# EAGLE design 1_Main (EAGLE 7.6.0)
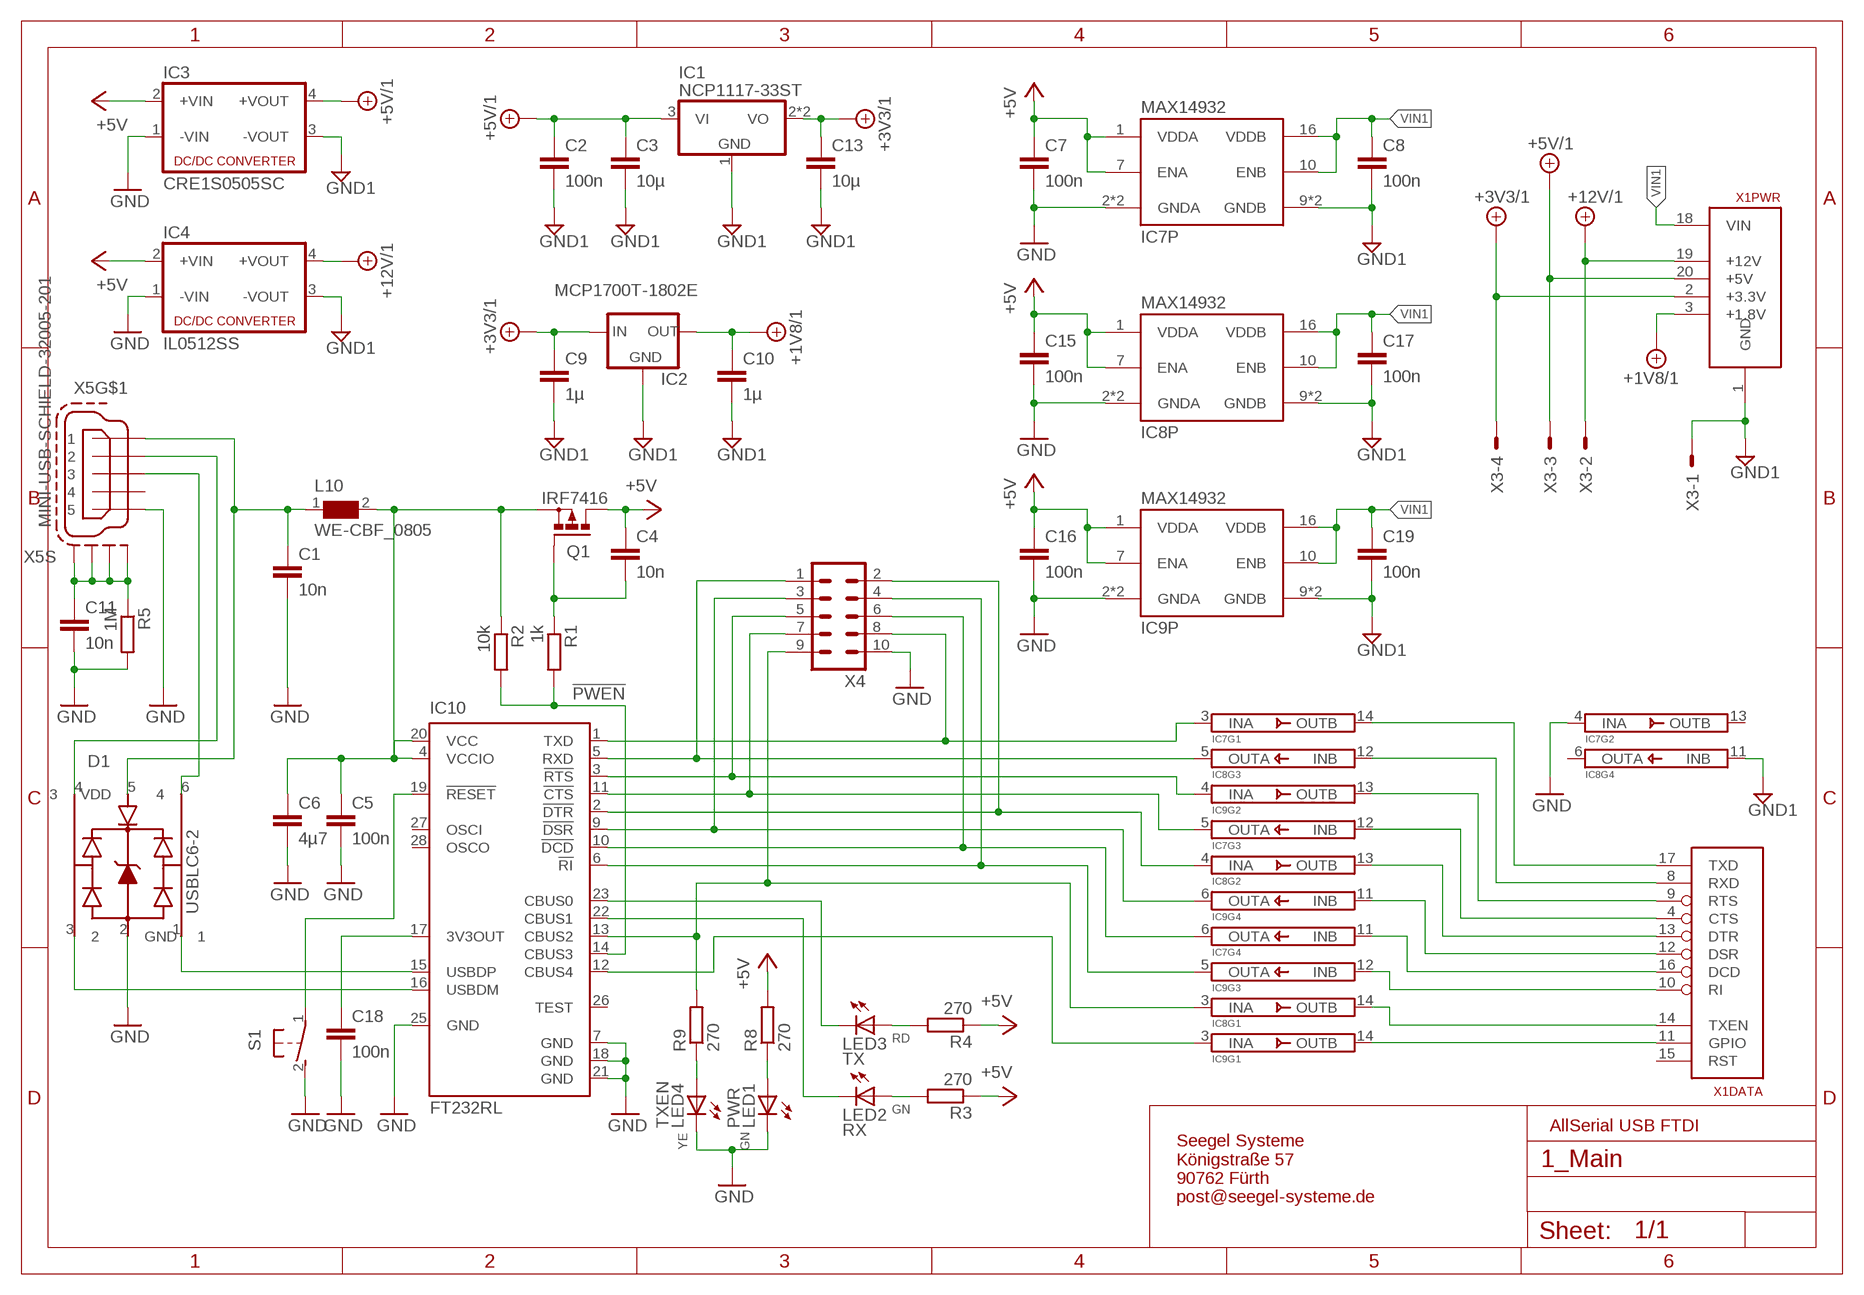
[diagram p0: schematic, sheet 1]

## Parts
C1  10n  C-EUC0805  [C0805]
C2  100n  C-EUC0805  [C0805]
C3  10µ  C-EUC0805  [C0805]
C4  10n  C-EUC0805  [C0805]
C5  100n  C-EUC0805  [C0805]
C6  4µ7  C-EUC0805  [C0805]
C7  100n  C-EUC0805  [C0805]
C8  100n  C-EUC0805  [C0805]
C9  1µ  C-EUC0805  [C0805]
C10  1µ  C-EUC0805  [C0805]
C11  10n  C-EUC0805  [C0805]
C13  10µ  C-EUC0805  [C0805]
C15  100n  C-EUC0805  [C0805]
C16  100n  C-EUC0805  [C0805]
C17  100n  C-EUC0805  [C0805]
C18  100n  C-EUC0805  [C0805]
C19  100n  C-EUC0805  [C0805]
D1  USBLC6-2  WE-TVS_82400102  [WE-TVS_SOT23-6L]
IC1  NCP1117-33ST  [SOT223]
IC2  MCP1700T-1802E  MCP170X  [SOT23]
IC3  CRE1S0505SC  [MURATA-SC]
IC4  IL0512SS  [XPPOWER-SIP]
IC7  MAX14932  [SO16]
IC8  MAX14932  [SO16]
IC9  MAX14932  [SO16]
IC10  FT232RL  [SSOP28]
L10  WE-CBF_0805  [0805]
LED1  PWR  LEDCHIPLED_0603  [CHIPLED_0603]
LED2  RX  LEDCHIPLED_0603  [CHIPLED_0603]
LED3  TX  LEDCHIPLED_0603  [CHIPLED_0603]
LED4  TXEN  LEDCHIPLED_0603  [CHIPLED_0603]
Q1  IRF7416  P-MOSFET-SO8  [SO-08]
R1  1k  R-EU_R0805  [R0805]
R2  10k  R-EU_R0805  [R0805]
R3  270  R-EU_R0805  [R0805]
R4  270  R-EU_R0805  [R0805]
R5  1M  R-EU_R0805  [R0805]
R8  270  R-EU_R0805  [R0805]
R9  270  R-EU_R0805  [R0805]
S1  31-XX  [B3F-31XX]
X1  ALLSERIALMASTERMM  [MAIN-THT]
X3  AKL18X-04W  [AKL182-04]
X4  ML10  [ML10]
X5  MINI-USB-SCHIELD-32005-201  [32005-201]

## Nets
!PWEN: IC10.14(CBUS3) R1.2 R2.2
+1V8/1: C10.1 IC2.2(OUT) X1.3(PWR:+1.8V)
+3V3/1: C9.1 C13.1 IC1.2(VO) IC1.4(VO) IC2.3(IN) X1.2(PWR:+3.3V) X3.P$4
+5V: C4.1 C7.1 C15.1 C16.1 IC3.2(+VIN) IC4.2(+VIN) IC7.1(P:VDDA) IC7.7(P:ENA) IC8.1(P:VDDA) IC8.7(P:ENA) IC9.1(P:VDDA) IC9.7(P:ENA) Q1.5(D) Q1.6(D) Q1.7(D) Q1.8(D) R3.1 R4.1 R8.2
+5V/1: C2.1 C3.1 IC1.3(VI) IC3.4(+VOUT) X1.20(PWR:+5V) X3.P$3
+12V/1: IC4.4(+VOUT) X1.19(PWR:+12V) X3.P$2
GND: C1.2 C5.2 C6.2 C7.2 C11.2 C15.2 C16.2 C18.2 D1.2(GND) IC3.1(-VIN) IC4.1(-VIN) IC7.2(P:GNDA) IC7.4(INA) IC7.8(P:GNDA) IC8.2(P:GNDA) IC8.8(P:GNDA) IC9.2(P:GNDA) IC9.8(P:GNDA) IC10.7(GND) IC10.18(GND) IC10.21(GND) IC10.25(GND) LED1.C LED4.C R5.2 S1.2(S) X4.10 X5.5
GND1: C2.2 C3.2 C8.2 C9.2 C10.2 C13.2 C17.2 C19.2 IC1.1(GND) IC2.1(GND) IC3.3(-VOUT) IC4.3(-VOUT) IC7.9(P:GNDB) IC7.15(P:GNDB) IC8.9(P:GNDB) IC8.11(INB) IC8.15(P:GNDB) IC9.9(P:GNDB) IC9.15(P:GNDB) X1.1(PWR:GND) X3.P$1
N$1: IC8.5(OUTA) IC10.5(RXD) X4.1
N$2: IC9.6(OUTA) IC10.9(!DSR) X4.3
N$3: IC8.3(INA) IC10.13(CBUS2) R9.2 X4.9
N$4: LED2.A R3.2
N$5: IC10.19(!RESET) S1.1(P)
N$6: LED3.A R4.2
N$7: LED4.A R9.1
N$8: LED1.A R8.1
N$9: D1.3 IC10.16(USBDM)
N$10: D1.1 IC10.15(USBDP)
N$11: C1.1 D1.5(VDD) L10.1 X5.1
N$12: D1.4 X5.2
N$13: IC9.3(INA) IC10.12(CBUS4)
N$14: IC7.3(INA) IC10.1(TXD) X4.8
N$15: D1.6 X5.3
N$16: C11.1 R5.1 X5.M1(S:S1) X5.M2(S:S2) X5.M3(S:S3) X5.M4(S:S4)
N$22: C18.1 IC10.17(3V3OUT)
N$29: IC9.4(INA) IC10.3(!RTS) X4.5
N$32: IC7.5(OUTA) IC10.11(!CTS) X4.7
N$33: IC8.4(INA) IC10.2(!DTR) X4.2
N$35: IC7.6(OUTA) IC10.10(!DCD) X4.6
N$36: IC9.5(OUTA) IC10.6(!RI) X4.4
N$38: C5.1 C6.1 IC10.4(VCCIO) IC10.20(VCC) L10.2 Q1.1(S) Q1.2(S) Q1.3(S) R2.1
N$42: C4.2 Q1.4(G) R1.1
N$80: IC7.14(OUTB) X1.17(DATA:TXD)
N$81: IC8.12(INB) X1.8(DATA:RXD)
N$82: IC9.13(OUTB) X1.9(DATA:RTS)
N$83: IC7.12(INB) X1.4(DATA:CTS)
N$84: IC8.13(OUTB) X1.13(DATA:DTR)
N$85: IC9.11(INB) X1.12(DATA:DSR)
N$86: IC7.11(INB) X1.16(DATA:DCD)
N$87: IC9.12(INB) X1.10(DATA:RI)
N$88: IC8.14(OUTB) X1.14(DATA:TXEN)
N$89: IC9.14(OUTB) X1.11(DATA:GPIO)
RXLED: IC10.22(CBUS1) LED2.C
TXLED: IC10.23(CBUS0) LED3.C
VIN1: C8.1 C17.1 C19.1 IC7.10(P:ENB) IC7.16(P:VDDB) IC8.10(P:ENB) IC8.16(P:VDDB) IC9.10(P:ENB) IC9.16(P:VDDB) X1.18(PWR:VIN)
Unconnected: IC7.13(OUTB) IC8.6(OUTA) IC10.26(TEST) IC10.27(OSCI) IC10.28(OSCO) X1.5(USB:D-) X1.6(USB:D+) X1.7(USB:VUSB) X1.15(DATA:RST) X5.4

## Notes on the sheet
- AllSerial USB FTDI
- Seegel Systeme
  Königstraße 57
  90762 Fürth
  post@seegel-systeme.de

## Library data of the parts
C1-C11 C13 C15-C19 = rcl:C-EU: CAPACITOR, European symbol
D1 = EagleLibrary_Wuerth_Elektronik_eiSos_Version_6-9:WE-TVS_82400102: TVS Diode Array WE-TVS, High Speed Series - Low capazity - No leakage current - Low clamping voltage - high ESD voltage protection -- USB 1.0 - 2.0 Flow Thru Design
IC1 = linear:NCP1117
IC2 = SeeSys:MCP170X
IC3 = dc-dc-converter:CRE1S*?
IC4 = dc-dc-converter:IL*S
IC7-IC9 = max14932:MAX14932
IC10 = ftdichip:FT232R: Source: http://www.ftdichip.com/Documents/DataSheets/DS_FT232R_v104.pdf; MPN: FT232RL; OC_FARNELL: 1146032; OC_NEWARK: 91K9918
L10 = EagleLibrary_Wuerth_Elektronik_eiSos_Version_6-12:WE-CBF: SMD EMI Suppression Ferrite Beads WE-CBF - Excellent anti-EMI properties - Low DC-restistance - Impedances till 3000 ohms - Rated current up to 6 A -- Reliable Ni-Sn electrodes -- Perfect as data lined filter and for uncoupling of distribution voltage
LED1 LED2 = led:LED: LED OSRAM: - CHIPLED LG R971, LG N971, LY N971, LG Q971, LY Q971, LO R971, LY R971 LH N974, LH R974 LS Q976, LO Q976, LY Q976 LO Q996 - Hyper CHIPLED LW Q18S LB Q993, LB Q99A, LB R99A - SideLED LS A670, LO A670, LY A670, LG A670, LP A670 LB A673, LV A673, LT A673, LW A673 LH A674 LY A675 LS A676, LA A676, LO A676, LY A676, LW A676 LS A679, LY A679, LG A679 - Hyper Micro SIDELED® LS Y876, LA Y876, LO Y876, LY Y876 LT Y87S - SmartLED LW L88C, LW L88S LB L89C, LB L89S, LG L890 LS L89K, LO L89K, LY L89K LS L896, LA L896, LO L896, LY L896 - TOPLED LS T670, LO T670, LY T670, LG T670, LP T670 LSG T670, LSP T670, LSY T670, LOP T670, LYG T670 LG T671, LOG T671, LSG T671 LB T673, LV T673, LT T673, LW T673 LH T674 LS T676, LA T676, LO T676, LY T676, LB T676, LH T676, LSB T676, LW T676 LB T67C, LV T67C, LT T67C, LS T67K, LO T67K, LY T67K, LW E67C LS E67B, LA E67B, LO E67B, LY E67B, LB E67C, LV E67C, LT E67C LW T67C LS T679, LY T679, LG T679 LS T770, LO T770, LY T770, LG T770, LP T770 LB T773, LV T773, LT T773, LW T773 LH T774 LS E675, LA E675, LY E675, LS T675 LS T776, LA T776, LO T776, LY T776, LB T776 LHGB T686 LT T68C, LB T68C - Hyper Mini TOPLED® LB M676 - Mini TOPLED Santana® LG M470 LS M47K, LO M47K, LY M47K Source: http://www.osram.convergy.de LUXEON: - LUMILED® LXK2-PW12-R00, LXK2-PW12-S00, LXK2-PW14-U00, LXK2-PW14-V00 LXK2-PM12-R00, LXK2-PM12-S00, LXK2-PM14-U00 LXK2-PE12-Q00, LXK2-PE12-R00, LXK2-PE12-S00, LXK2-PE14-T00, LXK2-PE14-U00 LXK2-PB12-K00, LXK2-PB12-L00, LXK2-PB12-M00, LXK2-PB14-N00, LXK2-PB14-P00, LXK2-PB14-Q00 LXK2-PR12-L00, LXK2-PR12-M00, LXK2-PR14-Q00, LXK2-PR14-R00 LXK2-PD12-Q00, LXK2-PD12-R00, LXK2-PD12-S00 LXK2-PH12-R00, LXK2-PH12-S00 LXK2-PL12-P00, LXK2-PL12-Q00, LXK2-PL12-R00 Source: www.luxeon.com KINGBRIGHT: KA-3528ASYC Source: www.kingbright.com; COLOR: GN
LED3 = led:LED: LED OSRAM: - CHIPLED LG R971, LG N971, LY N971, LG Q971, LY Q971, LO R971, LY R971 LH N974, LH R974 LS Q976, LO Q976, LY Q976 LO Q996 - Hyper CHIPLED LW Q18S LB Q993, LB Q99A, LB R99A - SideLED LS A670, LO A670, LY A670, LG A670, LP A670 LB A673, LV A673, LT A673, LW A673 LH A674 LY A675 LS A676, LA A676, LO A676, LY A676, LW A676 LS A679, LY A679, LG A679 - Hyper Micro SIDELED® LS Y876, LA Y876, LO Y876, LY Y876 LT Y87S - SmartLED LW L88C, LW L88S LB L89C, LB L89S, LG L890 LS L89K, LO L89K, LY L89K LS L896, LA L896, LO L896, LY L896 - TOPLED LS T670, LO T670, LY T670, LG T670, LP T670 LSG T670, LSP T670, LSY T670, LOP T670, LYG T670 LG T671, LOG T671, LSG T671 LB T673, LV T673, LT T673, LW T673 LH T674 LS T676, LA T676, LO T676, LY T676, LB T676, LH T676, LSB T676, LW T676 LB T67C, LV T67C, LT T67C, LS T67K, LO T67K, LY T67K, LW E67C LS E67B, LA E67B, LO E67B, LY E67B, LB E67C, LV E67C, LT E67C LW T67C LS T679, LY T679, LG T679 LS T770, LO T770, LY T770, LG T770, LP T770 LB T773, LV T773, LT T773, LW T773 LH T774 LS E675, LA E675, LY E675, LS T675 LS T776, LA T776, LO T776, LY T776, LB T776 LHGB T686 LT T68C, LB T68C - Hyper Mini TOPLED® LB M676 - Mini TOPLED Santana® LG M470 LS M47K, LO M47K, LY M47K Source: http://www.osram.convergy.de LUXEON: - LUMILED® LXK2-PW12-R00, LXK2-PW12-S00, LXK2-PW14-U00, LXK2-PW14-V00 LXK2-PM12-R00, LXK2-PM12-S00, LXK2-PM14-U00 LXK2-PE12-Q00, LXK2-PE12-R00, LXK2-PE12-S00, LXK2-PE14-T00, LXK2-PE14-U00 LXK2-PB12-K00, LXK2-PB12-L00, LXK2-PB12-M00, LXK2-PB14-N00, LXK2-PB14-P00, LXK2-PB14-Q00 LXK2-PR12-L00, LXK2-PR12-M00, LXK2-PR14-Q00, LXK2-PR14-R00 LXK2-PD12-Q00, LXK2-PD12-R00, LXK2-PD12-S00 LXK2-PH12-R00, LXK2-PH12-S00 LXK2-PL12-P00, LXK2-PL12-Q00, LXK2-PL12-R00 Source: www.luxeon.com KINGBRIGHT: KA-3528ASYC Source: www.kingbright.com; COLOR: RD
LED4 = led:LED: LED OSRAM: - CHIPLED LG R971, LG N971, LY N971, LG Q971, LY Q971, LO R971, LY R971 LH N974, LH R974 LS Q976, LO Q976, LY Q976 LO Q996 - Hyper CHIPLED LW Q18S LB Q993, LB Q99A, LB R99A - SideLED LS A670, LO A670, LY A670, LG A670, LP A670 LB A673, LV A673, LT A673, LW A673 LH A674 LY A675 LS A676, LA A676, LO A676, LY A676, LW A676 LS A679, LY A679, LG A679 - Hyper Micro SIDELED® LS Y876, LA Y876, LO Y876, LY Y876 LT Y87S - SmartLED LW L88C, LW L88S LB L89C, LB L89S, LG L890 LS L89K, LO L89K, LY L89K LS L896, LA L896, LO L896, LY L896 - TOPLED LS T670, LO T670, LY T670, LG T670, LP T670 LSG T670, LSP T670, LSY T670, LOP T670, LYG T670 LG T671, LOG T671, LSG T671 LB T673, LV T673, LT T673, LW T673 LH T674 LS T676, LA T676, LO T676, LY T676, LB T676, LH T676, LSB T676, LW T676 LB T67C, LV T67C, LT T67C, LS T67K, LO T67K, LY T67K, LW E67C LS E67B, LA E67B, LO E67B, LY E67B, LB E67C, LV E67C, LT E67C LW T67C LS T679, LY T679, LG T679 LS T770, LO T770, LY T770, LG T770, LP T770 LB T773, LV T773, LT T773, LW T773 LH T774 LS E675, LA E675, LY E675, LS T675 LS T776, LA T776, LO T776, LY T776, LB T776 LHGB T686 LT T68C, LB T68C - Hyper Mini TOPLED® LB M676 - Mini TOPLED Santana® LG M470 LS M47K, LO M47K, LY M47K Source: http://www.osram.convergy.de LUXEON: - LUMILED® LXK2-PW12-R00, LXK2-PW12-S00, LXK2-PW14-U00, LXK2-PW14-V00 LXK2-PM12-R00, LXK2-PM12-S00, LXK2-PM14-U00 LXK2-PE12-Q00, LXK2-PE12-R00, LXK2-PE12-S00, LXK2-PE14-T00, LXK2-PE14-U00 LXK2-PB12-K00, LXK2-PB12-L00, LXK2-PB12-M00, LXK2-PB14-N00, LXK2-PB14-P00, LXK2-PB14-Q00 LXK2-PR12-L00, LXK2-PR12-M00, LXK2-PR14-Q00, LXK2-PR14-R00 LXK2-PD12-Q00, LXK2-PD12-R00, LXK2-PD12-S00 LXK2-PH12-R00, LXK2-PH12-S00 LXK2-PL12-P00, LXK2-PL12-Q00, LXK2-PL12-R00 Source: www.luxeon.com KINGBRIGHT: KA-3528ASYC Source: www.kingbright.com; COLOR: YE
Q1 = transistor-power:P-MOSFET-SO8: P-Channel MOSFET Example: FDS4435A; P-Channel Logic Level PowerTrench® MOSFET FDS4465; P-Channel 1.8V Specified PowerTrench® MOSFET Source: www.fairchildsemi.com
R1-R5 R8 R9 = rcl:R-EU_: RESISTOR, European symbol
S1 = switch-omron:31-XX: OMRON SWITCH; MPN: B3F-3100; OC_FARNELL: 959704; OC_NEWARK: 36M3582
X1 = AllSerialv2:ALLSERIALMASTER
X3 = con-riacon_akl:AKL18X-04: Riacon AKL18X Steckverbinder 4-Pol Grid = 3,5mm
X4 = con-harting-ml:ML10: HARTING; OC_FARNELL: unknown; OC_NEWARK: unknown
X5 = con-cypressindustries:MINI-USB-SCHIELD-: MINI USB-B Conector Source: www.cypressindustries.com; OC_FARNELL: unknown; OC_NEWARK: unknown

## Board
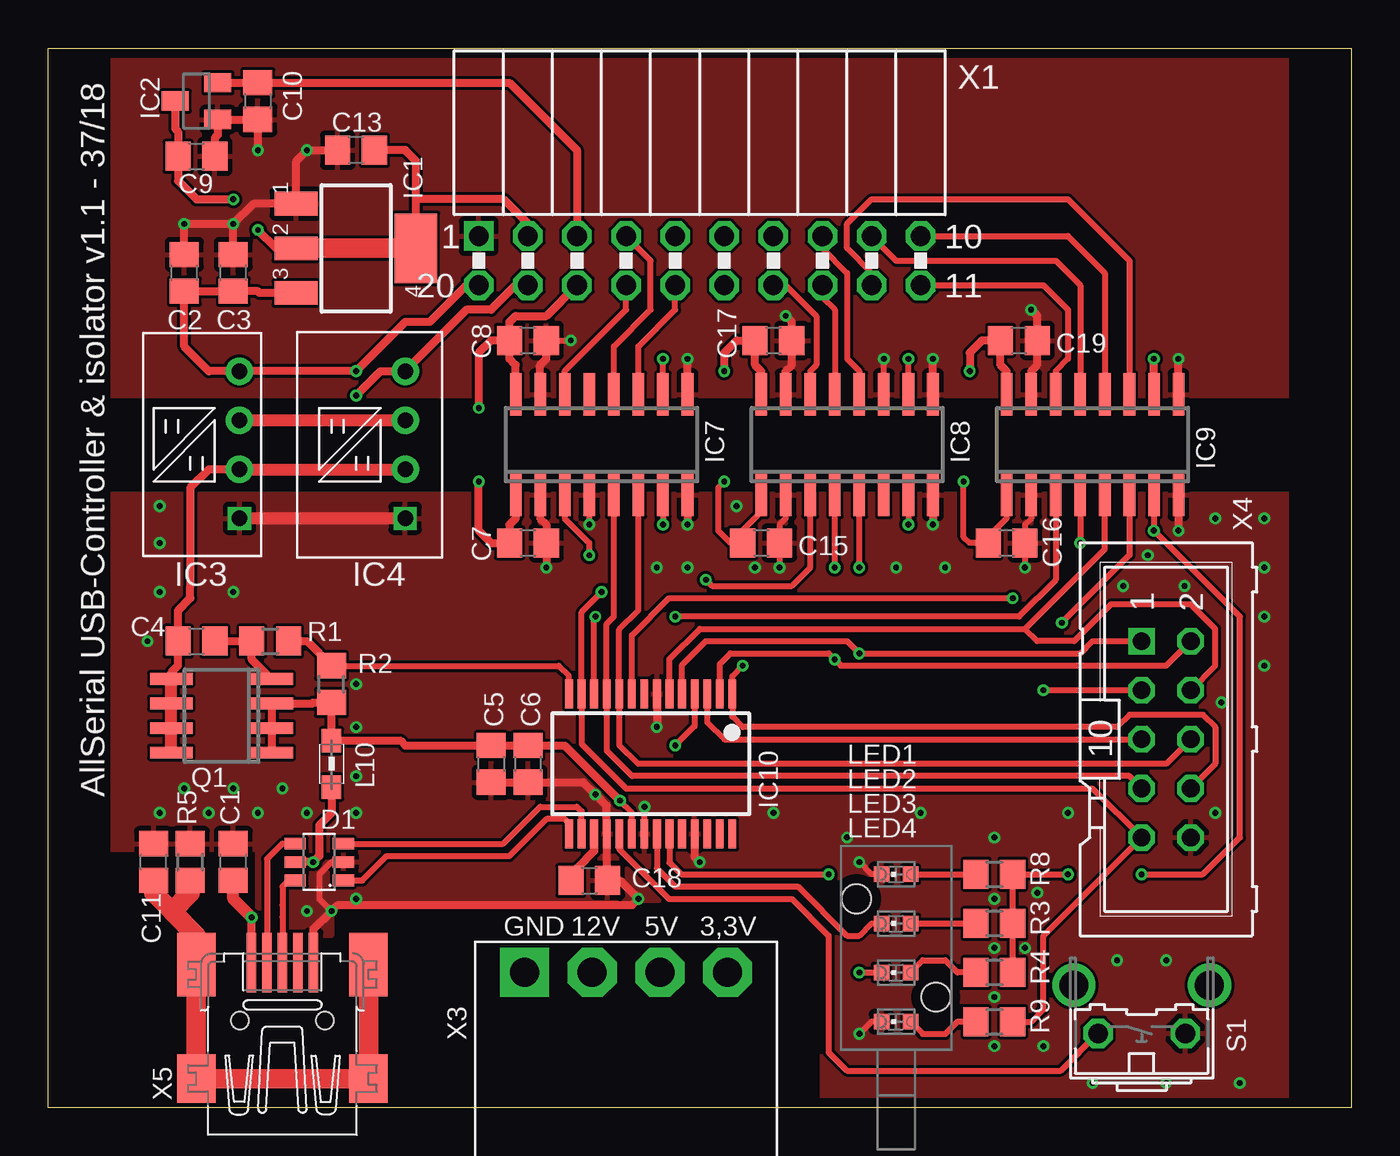
[diagram p1: board, top side]
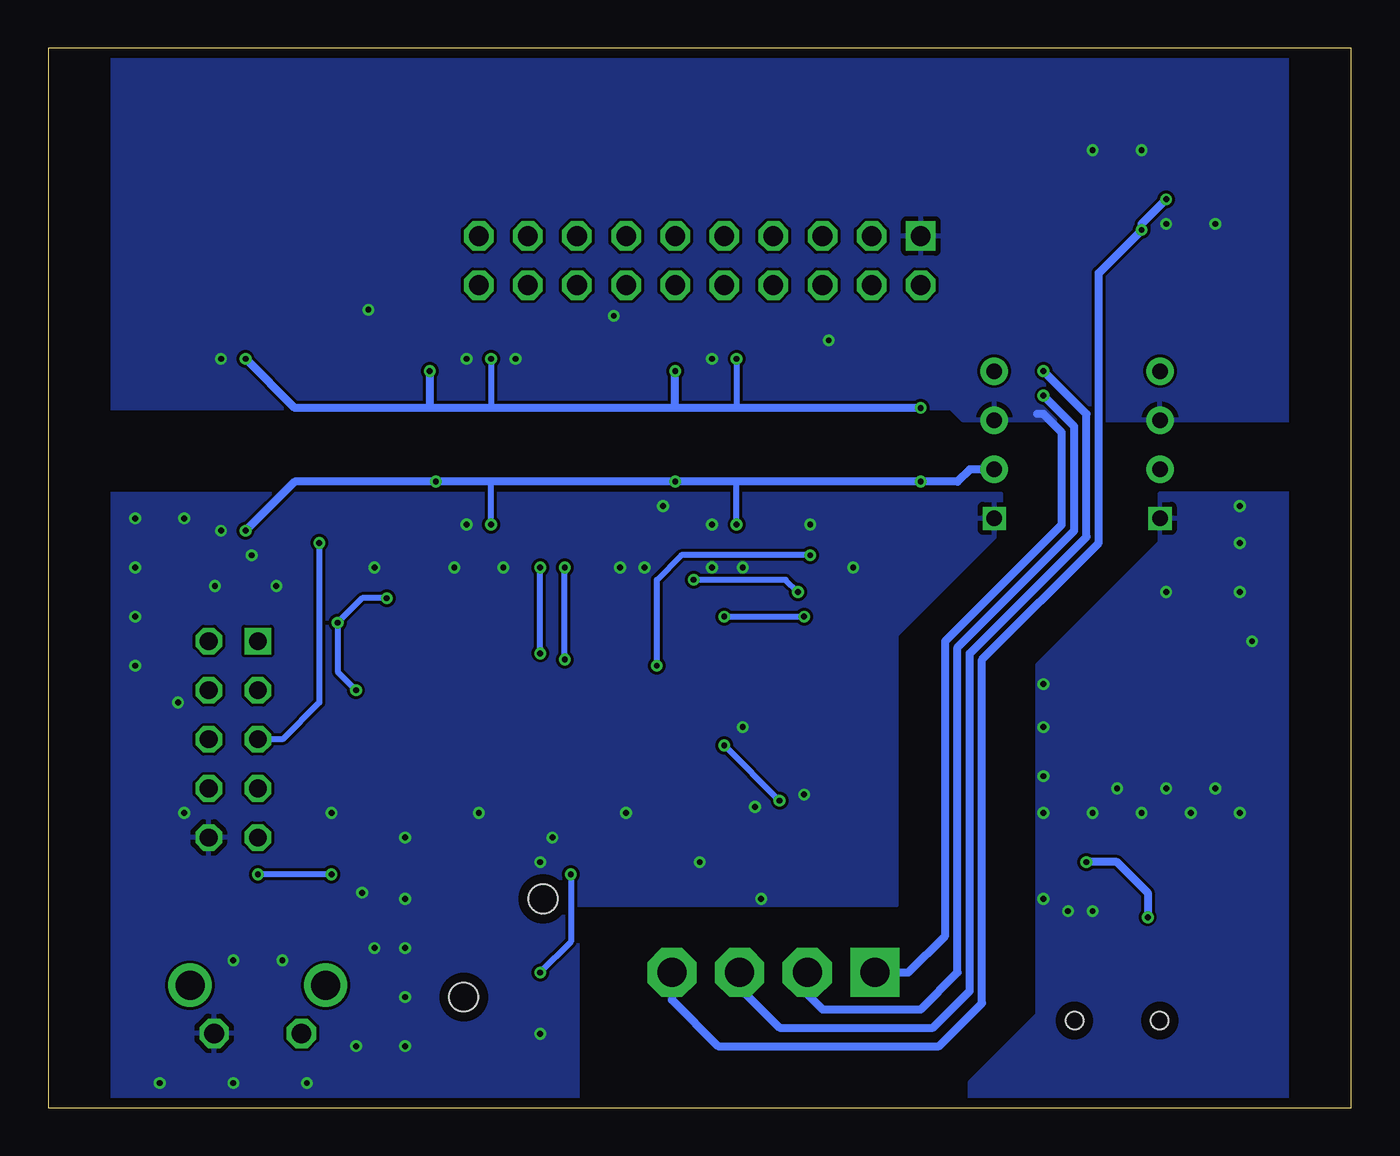
[diagram p2: board, bottom side, seen from below]

Size 67.4 x 54.8 mm. Coordinates in mm from the lower left corner, seen from the top.
Copper layers (1*16): Top 0.035mm / dielectric 1.6mm / Bottom 0.035mm
Design rules "Elecrow_2-layer_PCB_eagle_rule *": minimum track width 6mil, minimum drill 0.3mm, track to track 6mil, track to pad 6mil, pad to pad 6mil, via to via 8mil, smd to smd 0mil, copper to edge 20mil, drill to drill 10mil, minimum pad ring 6mil, minimum via ring 6mil, stop-mask expansion 0mil, vias tented up to drill 100mil, thermal gap 10mil

### Footprints (pad centres in the part's own frame; a part is rotated, then mirrored left to right if it is on the bottom)
C0805 = smd 1.3 x 1.5: 1 -0.95,0; 2 0.95,0
WE-TVS_SOT23-6L = smd 0.6 x 1.1: 1 -0.95,-1.25; 2 0,-1.25; 3 0.95,-1.25; 4 0.95,1.25; 5 0,1.25; 6 -0.95,1.25
SOT223 = smd 1.219 x 2.235: 1 -2.311,-3.099; 2 0,-3.099; 3 2.311,-3.099 | smd 3.6 x 2.2: 4 0,3.099
SOT23 = smd 1 x 1.4: 1 -0.95,-1.1; 2 0.95,-1.1; 3 0,1.1
MURATA-SC = drill 0.8 square: 1 -3.81,0 | drill 0.8 pad 1.422: 2 -1.27,0; 3 1.27,0; 4 3.81,0
XPPOWER-SIP = drill 0.8 square: 1 -3.81,0 | drill 0.8 pad 1.422: 2 -1.27,0; 3 1.27,0; 4 3.81,0
SO16 = smd 0.6 x 2.2: 1 -4.445,-2.6; 2 -3.175,-2.6; 3 -1.905,-2.6; 4 -0.635,-2.6; 5 0.635,-2.6; 6 1.905,-2.6; 7 3.175,-2.6; 8 4.445,-2.6; 9 4.445,2.6; 10 3.175,2.6; 11 1.905,2.6; 12 0.635,2.6; 13 -0.635,2.6; 14 -1.905,2.6; 15 -3.175,2.6; 16 -4.445,2.6
SSOP28 = smd 0.4 x 1.5: 1 -4.225,-3.625; 2 -3.575,-3.625; 3 -2.925,-3.625; 4 -2.275,-3.625; 5 -1.625,-3.625; 6 -0.975,-3.625; 7 -0.325,-3.625; 8 0.325,-3.625; 9 0.975,-3.625; 10 1.625,-3.625; 11 2.275,-3.625; 12 2.925,-3.625; 13 3.575,-3.625; 14 4.225,-3.625; 15 4.225,3.625; 16 3.575,3.625; 17 2.925,3.625; 18 2.275,3.625; 19 1.625,3.625; 20 0.975,3.625; 21 0.325,3.625; 22 -0.325,3.625; 23 -0.975,3.625; 24 -1.625,3.625; 25 -2.275,3.625; 26 -2.925,3.625; 27 -3.575,3.625; 28 -4.225,3.625
0805 = smd 1.2 x 1: 1 -1.2,0; 2 1.2,0
CHIPLED_0603 = smd 0.8 x 0.8: A 0,-0.75; C 0,0.75
SO-08 = smd 0.6 x 2.2: 1 -1.905,-2.6; 2 -0.635,-2.6; 3 0.635,-2.6; 4 1.905,-2.6; 5 1.905,2.6; 6 0.635,2.6; 7 -0.635,2.6; 8 -1.905,2.6
R0805 = smd 1.3 x 1.5: 1 -0.95,0; 2 0.95,0
B3F-31XX = drill 1.016 octagon: 1 -2.261,-1.245; 2 2.261,-1.245 | drill 1.499 pad 2.159: 3 -3.505,1.245; 4 3.505,1.245
1296.1004 = hole 1.5: 2.05,-2.54; -2.05,2.54
MAIN-THT = drill 1.016 square: 1 -11.43,45.085 | drill 1.016 octagon: 2 -8.89,45.085; 3 -6.35,45.085; 4 -3.81,45.085; 5 -1.27,45.085; 6 1.27,45.085; 7 3.81,45.085; 8 6.35,45.085; 9 8.89,45.085; 10 11.43,45.085; 11 11.43,42.545; 12 8.89,42.545; 13 6.35,42.545; 14 3.81,42.545; 15 1.27,42.545; 16 -1.27,42.545; 17 -3.81,42.545; 18 -6.35,42.545; 19 -8.89,42.545; 20 -11.43,42.545
AKL182-04 = drill 1.5 pad 2.54 square: P$1 -5.25,0 | drill 1.5 pad 2.54 octagon: P$2 -1.75,0; P$3 1.75,0; P$4 5.25,0
ML10 = drill 0.914 square: 1 -5.08,-1.27 | drill 0.914 octagon: 2 -5.08,1.27; 3 -2.54,-1.27; 4 -2.54,1.27; 5 0,-1.27; 6 0,1.27; 7 2.54,-1.27; 8 2.54,1.27; 9 5.08,-1.27; 10 5.08,1.27
32005-201 = smd 3.1 x 0.5: 1 3,1.6; 2 3,0.8; 3 3,0; 4 3,-0.8; 5 3,-1.6 | smd 2.5 x 2: M1 -3,-4.45; M2 -3,4.45 | smd 3.3 x 2: M3 2.9,4.45; M4 2.9,-4.45 | hole 0.9: 0,2.2; 0,-2.2

### Placement (x,y rotation side)
C1  9.57,12.7 90 top
C2  7.03,43.18 90 top
C3  9.57,43.18 90 top
C4  7.67,24.13 0 top
C5  22.91,17.78 270 top
C6  24.81,17.78 270 top
C7  24.81,29.21 0 top
C8  24.81,39.69 0 top
C9  7.67,49.21 0 top
C10  10.84,52.07 270 top
C11  5.44,12.7 90 top
C13  15.92,49.53 180 top
C15  36.88,29.21 0 top
C16  49.58,29.21 0 top
C17  37.51,39.69 0 top
C18  27.99,11.75 0 top
C19  50.21,39.69 0 top
D1  14.02,12.7 90 top
IC1  15.92,44.45 270 top
IC2  7.67,52.07 90 top
IC3  9.89,34.29 90 top
IC4  18.46,34.29 90 top
IC7  28.62,34.29 0 top
IC8  41.32,34.29 0 top
IC9  54.02,34.29 0 top
IC10  31.16,17.78 180 top
L10  14.65,17.78 90 top
LED1  43.86,12.06 90 top
LED2  43.86,9.53 90 top
LED3  43.86,6.99 90 top
LED4  43.86,4.45 90 top
Q1  8.96,20.27 90 top
R1  11.48,24.13 0 top
R2  14.65,21.91 90 top
R3  48.94,9.53 180 top
R4  48.94,6.99 180 top
R5  7.35,12.7 90 top
R8  48.94,12.06 0 top
R9  48.94,4.45 0 top
S1  56.56,5.08 0 top
U$3  [1296.1004]  43.86,8.26 180 top
X1  33.7,0 0 top
X3  29.89,6.99 0 top
X4  57.83,19.05 270 top
X5  12.11,4.5 90 top

### Tracks (layer width: path | path; a pad name or v marks a point on that pad's centre or on a via)
!PWEN
  Top 0.305: R2.2 26.4,22.86 26.94,22.32 IC10.14
  Top 0.406: R1.2 13.38,24.13 R2.2
+1V8/1
  Top 0.406: IC2.2 C10.1 23.86,53.02 27.35,49.53 X1.3
+3V3/1  (via drill 0.3)
  Top 0.406: IC1.4 19.02,46.99 | 19.02,46.99 19.02,48.97 18.46,49.53 C13.1 | X1.2 24.81,45.72 23.54,46.99 19.02,46.99 | IC2.3 6.57,50.63 6.71,50.48 C9.1 6.72,47.94 7.67,46.99 v9.57,46.99 | IC1.2 11.79,44.45 v10.84,45.4
  Top 1.016: IC1.2 IC1.4
  Bottom 0.406: X3.P$4 35.14,5.57 32.75,3.17 21.32,3.17 19.1,5.4 19.1,23.18 13.06,29.21 13.06,43.18 v10.84,45.4 10.84,45.72 v9.57,46.99
+5V  (via drill 0.3)
  Top 0.305: IC7.7 v31.8,30.16 | IC8.7 v44.5,30.16 | IC9.7 v57.2,29.84 61.64,25.4 61.64,13.97 59.73,12.06 v56.56,12.06 | R4.1 R3.1 R8.2 v52.75,12.06 | IC8.1 36.88,30.8 35.92,29.84 C15.1 35.29,29.21 34.65,29.84 34.65,32.07 v34.97,32.38 | IC9.1 49.58,30.48 48.94,29.84 48.94,29.52 C16.1 47.67,29.21 47.35,29.53 v47.35,32.38
  Top 0.406: IC7.1 24.18,30.48 23.86,30.16 C7.1 22.91,29.21 22.27,29.84 v22.27,32.38 | Q1.5 6.36,22.51 6.71,22.86 6.71,23.49 C4.1 6.72,25.71 7.35,26.35 7.35,26.99 7.35,32.07 8.3,33.02 IC3.2
  Top 0.61: IC3.2 IC4.2 | Q1.8 Q1.7 Q1.6 Q1.5
  Bottom 0.305: v31.8,30.16 31.8,32.38 | v44.5,30.16 44.5,32.38 | v52.75,12.06 v56.56,12.06
  Bottom 0.406: IC4.2 19.73,33.02 20.37,32.38 v22.27,32.38 31.8,32.38 v34.97,32.38 44.5,32.38 v47.35,32.38 54.66,32.38 v57.2,29.84
+5V/1  (via drill 0.3)
  Top 0.406: IC1.3 10.93,42.14 10.84,42.23 C3.1 C2.1 7.03,39.37 8.3,38.1 IC3.4 v15.92,38.1 18.46,40.64 19.73,40.64 21.64,42.55 X1.20
  Bottom 0.406: X3.P$3 31.64,6.2 29.57,4.13 21.64,4.13 19.73,6.03 19.73,23.5 13.7,29.53 13.7,35.88 v15.92,38.1
+12V/1  (via drill 0.3)
  Top 0.406: v15.92,36.83 17.19,38.1 IC4.4 21.64,41.27 22.91,41.27 24.18,42.55 X1.19
  Bottom 0.406: X3.P$2 28.14,5.87 27.35,5.08 22.27,5.08 20.37,6.99 20.37,23.81 14.33,29.84 14.33,35.24 v15.92,36.83
GND  (via drill 0.3)
  Top 0.305: 25.76,29.53 C7.2 | IC7.4 v27.99,30.16 | LED1.C 42.59,12.06 v41.96,12.7 | LED4.C 42.59,4.45 v41.96,3.81 | IC8.2 38.15,30.48 37.83,30.16 C15.2 | IC9.2 50.84,30.48 50.53,30.16 C16.2 v50.53,27.94 | C15.2 v37.83,27.94 | v28.3,16.2 v28.3,16.19 | D1.2 14.65,12.7 14.02,12.06 14.02,10.79 v14.65,10.16 | IC10.21 v30.84,15.55 v30.84,15.56
  Top 0.406: IC7.2 25.45,30.48 25.76,30.16 25.76,29.53 | IC10.7 31.49,19.69 v31.48,19.68 | IC7.8 v33.07,30.16 | C7.2 v25.76,27.94 | IC8.8 v45.77,30.16 | IC9.8 v58.47,29.84 | IC10.25 33.44,12.96 v33.7,12.7 | X5.5 13.71,9.22 v14.65,10.16 14.97,10.48 30.21,10.48 v30.53,10.79 29.57,11.75 C18.2 28.89,11.8 IC10.18 28.89,15.61 v28.3,16.19 27.67,16.83 C6.2 C5.2
  Top 0.61: IC4.1 IC3.1
  other vias: 13.38,10.16 5.76,15.24 8.3,15.24 10.84,15.24 13.38,15.24 7.03,16.51 9.57,16.51 12.11,16.51 15.92,10.79 35.61,31.11 31.48,27.94 33.07,27.94 36.56,27.94 43.86,27.94 46.4,27.94 56.88,28.57 55.61,26.99 58.78,26.99 60.37,30.48 62.91,30.48 62.91,27.94 62.91,25.4 62.91,22.86 60.69,20.95 60.37,15.24 55.29,7.62 57.83,7.62 61.64,1.27 57.83,1.27 54.02,1.27 51.48,3.17 51.16,11.11 50.53,8.26 48.94,8.26 48.94,5.71 48.94,3.17 48.94,10.79 52.75,15.24 48.94,13.97 45.13,15.24 41.32,13.97 37.51,15.24 9.57,26.67 5.76,26.67 5.76,29.21 5.76,31.11 5.13,24.13 15.92,19.68 15.92,21.91 15.92,17.14 15.92,15.24
  pour Bottom: 23.54,10.48 40.05,10.48 40.05,0 67.99,0 67.99,31.75 18.14,31.75 18.14,29.84 23.54,24.45
  pour Bottom: -0.59,31.75 9.89,31.75 9.89,29.21 16.24,22.86 16.24,4.76 19.73,1.27 19.73,0 -0.59,0
  pour Top: -0.59,31.75 67.99,31.75 67.99,0 40.05,0 40.05,10.79 14.65,10.48 14.65,8.89 10.84,8.89 10.84,13.34 -0.27,13.34
GND1  (via drill 0.3)
  Top 0.305: 25.76,39.37 C8.2 v27.03,39.69 | C17.2 | IC8.11 v43.23,38.73 | C19.2
  Top 0.406: IC7.15 25.45,38.42 25.76,38.73 25.76,39.37 | IC8.15 38.15,38.1 38.46,38.42 C17.2 | v9.57,45.72 10.61,46.76 IC1.1 12.82,48.97 v13.38,49.53 C13.2 | C2.2 v7.03,45.72 v9.57,45.72 | C3.2 v9.57,45.72 | C17.2 38.46,40.64 v38.15,40.96 | IC7.9 v33.07,38.73 | IC8.9 v45.77,38.73 | IC9.15 50.84,38.1 51.16,38.42 C19.2 | IC9.9 v58.47,38.73 | 51.16,40.96 v50.84,41.27 51.16,40.96 C19.2 | C9.2 8.62,50.16 8.77,50.31 IC2.1 C10.2 v10.84,49.53
  Top 0.61: IC3.3 IC4.3
  Bottom 0.406: X3.P$1 22.91,6.99 21,8.89 21,24.13 14.97,30.16 14.97,34.92 15.92,35.88 16.24,35.88
  pour Bottom: -0.59,54.61 -0.59,35.56 20.05,35.56 20.68,36.2 67.99,36.2 67.99,54.61
  pour Top: -0.59,36.83 67.99,36.83 67.99,54.61 -0.59,54.61
N$1  (via drill 0.3)
  Top 0.305: IC10.5 32.79,22.9 34.02,24.13 41.32,24.13 v41.96,23.5 53.39,23.5 54.02,24.13 X4.1 | v41.96,27.94 IC8.5
  Bottom 0.305: v41.96,23.5 v41.96,27.94
N$2  (via drill 0.3)
  Top 0.305: IC10.9 30.19,24.43 32.11,26.35 v49.89,26.35 | X4.3 v51.48,21.59 | IC9.6 55.93,28.57 v52.43,25.08
  Bottom 0.305: v51.48,21.59 52.43,22.54 v52.43,25.08 51.16,26.35 v49.89,26.35
N$3  (via drill 0.3)
  Top 0.305: v28.62,26.67 27.59,25.64 IC10.13 27.59,18.82 29.89,16.51 54.02,16.51 X4.9 51.48,8.89 51.48,5.08 50.84,4.45 R9.2 | v34.02,27.3 34.34,26.99 38.46,26.99 39.42,27.94 IC8.3
  Bottom 0.305: v28.62,26.67 29.26,27.3 v34.02,27.3
N$4
  Top 0.305: LED2.A R3.2
N$5
  Top 0.305: IC10.19 29.54,13.37 32.11,10.79 38.46,10.79 40.37,8.89 40.37,2.86 41.32,1.91 52.37,1.91 S1.1
N$6
  Top 0.305: LED3.A 45.25,7.62 46.4,7.62 47.04,6.99 R4.2
N$7
  Top 0.305: LED4.A 45.25,3.81 46.4,3.81 47.04,4.45 R9.1
N$8
  Top 0.305: LED1.A R8.1
N$9
  Top 0.305: D1.3 23.54,13.65 25.45,15.56 27.35,15.56 27.59,15.32 IC10.16
N$10
  Top 0.305: IC10.15 26.94,14.7 26.72,14.92 25.76,14.92 23.86,13.02 17.51,13.02 16.24,11.75 D1.1
N$11  (via drill 0.3)
  Top 0.406: L10.1 14.65,15.24 14.02,14.61 14.02,13.02 v13.7,12.7 D1.5 | X5.1 v10.51,9.83 v10.52,9.84
  Top 0.61: C1.1 9.57,10.79 v10.52,9.84
  Bottom 0.406: v13.7,12.7 12.11,12.7 10.52,11.11 v10.52,9.84
N$12
  Top 0.305: D1.4 12.11,13.65 11.31,12.85 X5.2
N$13  (via drill 0.3)
  Top 0.305: IC9.3 52.12,27.3 50.21,25.4 v32.43,25.4 | IC10.12 28.24,25.33 v28.3,25.4
  Bottom 0.305: v32.43,25.4 v28.3,25.4
N$14  (via drill 0.3)
  Top 0.305: IC7.3 26.72,30.48 27.99,29.21 v27.99,28.57 | v35.92,22.86 35.39,22.32 IC10.1 35.39,20.22 35.92,19.68 55.29,19.68 55.93,20.32 59.73,20.32 60.37,19.68 60.37,17.78 X4.8
  Bottom 0.305: v27.99,28.57 34.65,28.57 35.92,27.3 v35.92,22.86
N$15
  Top 0.305: D1.6 12.43,11.75 12.11,11.43 12.11,10.48 12.11,9.84 X5.3
N$16
  Top 1.016: X5.M4 X5.M1 X5.M2 X5.M3 7.66,8.89 6.4,10.16 | R5.1 7.35,11.11 6.4,10.16 | C11.1 5.44,11.11 6.4,10.16
N$22
  Top 0.406: IC10.17 28.24,13.27 27.35,12.38 27.35,12.06 C18.1
N$29  (via drill 0.3)
  Top 0.305: IC10.3 34.09,19.93 34.97,19.05 X4.5 | IC9.4 v53.39,29.21
  Bottom 0.305: v53.39,29.21 53.39,20.95 55.29,19.05 X4.5
N$32
  Top 0.305: IC7.5 29.26,25.4 28.89,25.03 IC10.11 28.89,18.47 30.21,17.14 55.93,17.14 X4.7
N$33  (via drill 0.3)
  Top 0.305: IC10.2 34.73,22.94 35.29,23.5 40.37,23.5 v40.69,23.18 41,22.86 57.83,22.86 X4.2 | v40.69,27.94 IC8.4
  Bottom 0.305: v40.69,23.18 v40.69,27.94
N$35
  Top 0.305: IC7.6 30.53,25.72 29.54,24.73 IC10.10 29.54,18.77 30.53,17.78 57.83,17.78 X4.6
N$36
  Top 0.305: IC10.6 32.14,23.2 33.7,24.77 50.53,24.77 | 50.53,24.77 54.66,28.89 IC9.5 | X4.4 60.37,22.86 60.37,24.77 59.1,26.04 54.97,26.04 53.07,24.13 51.16,24.13 50.53,24.77
N$38  (via drill 0.3)
  Top 0.305: IC10.20 30.19,15.26 v29.57,15.88 | IC10.4 33.44,19.74 v32.43,18.73
  Top 0.406: Q1.1 Q1.2 Q1.3 13.65,20.91 13.7,20.95 R2.1 L10.2 18.21,18.98 18.46,18.73 20.36,18.73 C5.1 C6.1 26.72,18.73 27.35,18.1 | v29.57,15.88 27.35,18.1 | 27.35,18.09 27.35,18.1
  Bottom 0.305: v29.57,15.88 v32.43,18.73
N$42
  Top 0.406: C4.2 R1.1 10.52,23.18 11.56,22.14 Q1.4
N$80
  Top 0.305: IC7.14 26.72,38.1 29.89,41.27 X1.17
N$81
  Top 0.305: X1.8 40.05,44.45 41.32,43.18 41.32,38.73 41.96,38.1 IC8.12
N$82
  Top 0.305: X1.9 43.86,43.81 52.12,43.81 53.39,42.55 IC9.13
N$83
  Top 0.305: IC7.12 29.26,39.37 31.16,41.27 31.16,43.81 X1.4
N$84
  Top 0.305: X1.13 40.05,41.91 40.69,41.27 IC8.13
N$85
  Top 0.305: X1.12 42.59,43.18 41.32,44.45 41.32,45.72 42.59,46.99 52.75,46.99 55.93,43.81 IC9.11
N$86
  Top 0.305: IC7.11 30.53,39.37 32.43,41.27 X1.16
N$87
  Top 0.305: X1.10 52.75,45.09 54.66,43.18 IC9.12
N$88
  Top 0.305: X1.14 38.15,42.55 39.73,40.96 39.73,38.42 39.42,38.1 IC8.14
N$89
  Top 0.305: X1.11 51.48,42.55 52.75,41.27 52.75,38.73 52.12,38.1 IC9.14
RXLED
  Top 0.305: IC10.22 31.49,12.38 32.43,11.43 38.78,11.43 41.32,8.89 41.96,8.89 42.59,9.53 LED2.C
TXLED  (via drill 0.3)
  Top 0.305: IC10.23 32.14,12.68 32.75,12.06 v40.37,12.06 | v41.96,6.99 LED3.C
  Bottom 0.305: v40.37,12.06 40.37,8.57 v41.96,6.99
VIN1  (via drill 0.3)
  Top 0.305: 23.86,39.37 C8.1 | IC7.10 v31.8,38.73 | 36.56,39.37 C17.1 | IC8.10 v44.5,38.73 | C19.1
  Top 0.406: IC7.16 24.18,38.42 23.86,38.73 23.86,39.37 | v22.27,36.2 22.27,39.05 22.91,39.69 C8.1 23.86,40.64 24.18,40.96 25.76,40.96 X1.18 | IC8.16 36.88,38.1 36.56,38.42 36.56,39.37 | v34.97,38.1 34.97,39.05 35.61,39.69 C17.1 | IC9.16 49.58,38.1 49.26,38.42 C19.1 | C19.1 48.31,39.69 47.67,39.05 v47.67,38.1 | IC9.10 v57.2,38.73
  Bottom 0.305: v31.8,38.73 31.8,36.2 | v44.5,38.73 44.5,36.2
  Bottom 0.406: v22.27,36.2 31.8,36.2 34.97,36.2 | 34.97,36.2 44.5,36.2 47.67,36.2 | 47.67,36.2 54.66,36.2 v57.2,38.73 | 34.97,36.2 v34.97,38.1 | v47.67,38.1 47.67,36.2

### Text on the board
tPlace: AllSerial USB-Controller & isolator v1.1 - 37/18 | GND | 12V | 5V | 3,3V